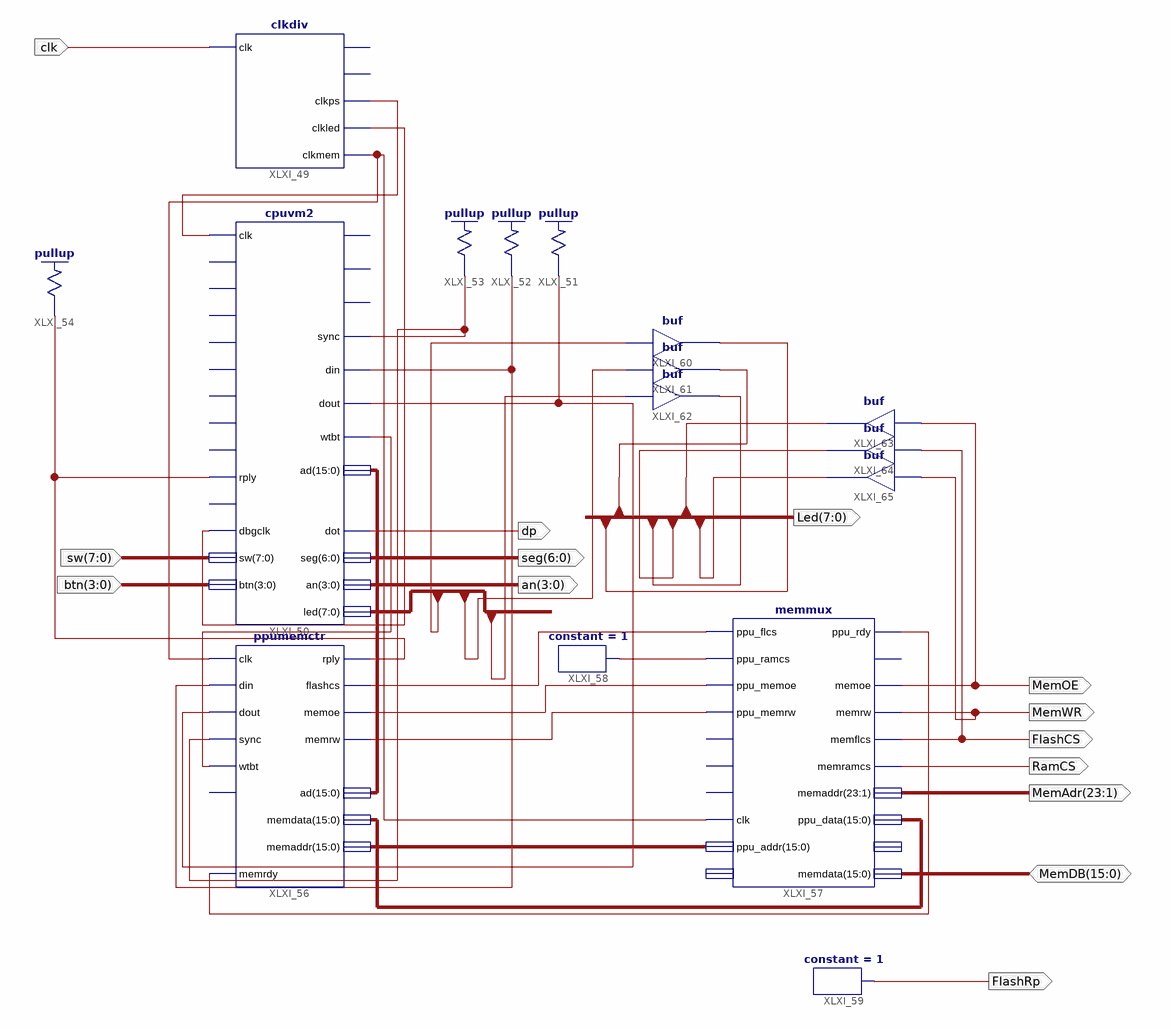
[diagram p0: schematic sheet 1]
// Xilinx ISE schematic top.sch (spartan3e) as structural Verilog: 16 symbols, 14 ports
module top (
  input  [7:0] sw,
  input  [3:0] btn,
  input  clk,
  inout  [15:0] MemDB,
  output dp,
  output [6:0] seg,
  output [3:0] an,
  output [7:0] Led,
  output MemOE,
  output MemWR,
  output FlashCS,
  output RamCS,
  output [23:1] MemAdr,
  output FlashRp
);

  wire XLXN_90, XLXN_98, XLXN_99, XLXN_101, XLXN_105, XLXN_106, XLXN_108, XLXN_109, XLXN_110, XLXN_114,
       XLXN_116, XLXN_146, XLXN_147;
  wire [7:0] leda;
  wire [15:0] XLXN_107, XLXN_111, XLXN_148;

  clkdiv XLXI_49 (.clk(clk), .clkps(XLXN_147), .clkled(XLXN_90), .clkmem(XLXN_146));  // open: clk6, clk8
  cpuvm2 XLXI_50 (
    .clk(XLXN_147), .rply(XLXN_101), .dbgclk(XLXN_90), .sw(sw), .btn(btn), .ad(XLXN_107), .sync(XLXN_105),
    .din(XLXN_98), .dout(XLXN_99), .wtbt(XLXN_106), .dot(dp), .seg(seg), .an(an), .led(leda));  // open: virq, evnt, halt, aclo, dclo, ar, dmr, sack, sel, dmgo, iako, init
  \pullup  XLXI_51 (.O(XLXN_99));
  \pullup  XLXI_52 (.O(XLXN_98));
  \pullup  XLXI_53 (.O(XLXN_105));
  \pullup  XLXI_54 (.O(XLXN_101));
  ppumemctr XLXI_56 (
    .clk(XLXN_146), .din(XLXN_98), .dout(XLXN_99), .sync(XLXN_105), .wtbt(XLXN_106), .ad(XLXN_107),
    .memdata(XLXN_148), .rply(XLXN_101), .flashcs(XLXN_108), .memoe(XLXN_109), .memrw(XLXN_110),
    .memaddr(XLXN_111), .memrdy(XLXN_116));  // open: halt
  memmux XLXI_57 (
    .ppu_flcs(XLXN_108), .ppu_ramcs(XLXN_114), .ppu_memoe(XLXN_109), .ppu_memrw(XLXN_110), .clk(XLXN_146),
    .ppu_addr(XLXN_111), .ppu_rdy(XLXN_116), .memoe(MemOE), .memrw(MemWR), .memflcs(FlashCS),
    .memramcs(RamCS), .memaddr(MemAdr), .ppu_data(XLXN_148), .memdata(MemDB));  // open: cpu_ramcs, cpu_memoe, cpu_memrw, cpu_addr, cpu_rdy, cpu_data
  constant #(.CValue("1")) XLXI_58 (.O(XLXN_114));
  constant #(.CValue("1")) XLXI_59 (.O(FlashRp));
  buf XLXI_60 (Led[0], leda[0]);
  buf XLXI_61 (Led[1], leda[1]);
  buf XLXI_62 (Led[2], leda[2]);
  buf XLXI_63 (Led[7], MemOE);
  buf XLXI_64 (Led[6], FlashCS);
  buf XLXI_65 (Led[5], MemWR);
endmodule
